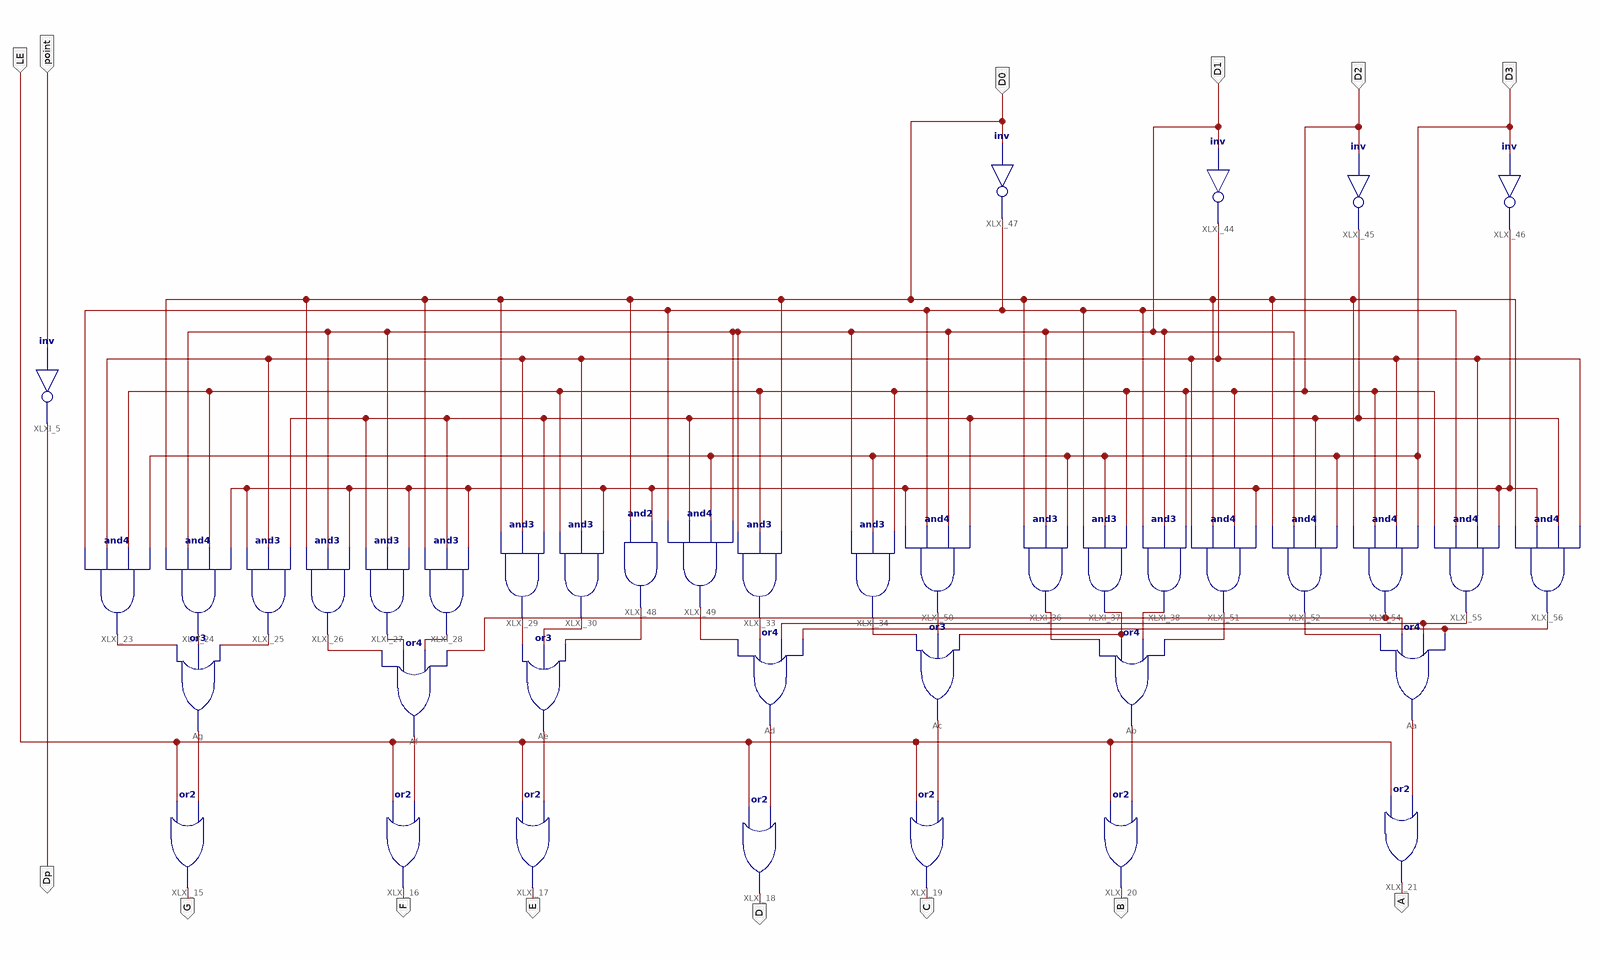
[diagram p0: schematic sheet 1]
// Xilinx ISE schematic MyMc14495.sch (kintex7) as structural Verilog: 40 symbols, 14 ports
module MyMc14495 (
  input  LE,
  input  point,
  input  D0,
  input  D1,
  input  D2,
  input  D3,
  output Dp,
  output G,
  output F,
  output E,
  output D,
  output C,
  output B,
  output A
);

  wire XLXN_5, XLXN_6, XLXN_7, XLXN_8, XLXN_9, XLXN_10, XLXN_11, XLXN_12, XLXN_13, XLXN_14, XLXN_19, XLXN_21,
       XLXN_22, XLXN_23, XLXN_24, XLXN_25, XLXN_36, XLXN_37, XLXN_38, XLXN_39, XLXN_40, XLXN_41, XLXN_42,
       XLXN_43, XLXN_46, XLXN_50, XLXN_51, XLXN_52, XLXN_69, XLXN_73, XLXN_79, XLXN_83;

  not XLXI_5 (Dp, point);
  or Ag (XLXN_5, XLXN_13, XLXN_12, XLXN_14);
  or Ae (XLXN_7, XLXN_23, XLXN_24, XLXN_25);
  or Ac (XLXN_9, XLXN_38, XLXN_39, XLXN_41);
  or Aa (XLXN_11, XLXN_46, XLXN_50, XLXN_51, XLXN_52);
  or Ad (XLXN_8, XLXN_36, XLXN_37, XLXN_51, XLXN_52);
  or Ab (XLXN_10, XLXN_40, XLXN_41, XLXN_42, XLXN_43);
  or XLXI_15 (G, LE, XLXN_5);
  or XLXI_16 (F, LE, XLXN_6);
  or XLXI_17 (E, LE, XLXN_7);
  or XLXI_18 (D, LE, XLXN_8);
  or XLXI_19 (C, LE, XLXN_9);
  or XLXI_20 (B, LE, XLXN_10);
  or XLXI_21 (A, LE, XLXN_11);
  or Af (XLXN_6, XLXN_22, XLXN_19, XLXN_21, XLXN_50);
  and XLXI_23 (XLXN_13, XLXN_69, XLXN_73, D2, D3);
  and XLXI_24 (XLXN_12, D0, D1, D2, XLXN_83);
  and XLXI_25 (XLXN_14, XLXN_83, XLXN_73, XLXN_79);
  and XLXI_26 (XLXN_22, D0, D1, XLXN_83);
  and XLXI_27 (XLXN_19, XLXN_79, D1, XLXN_83);
  and XLXI_28 (XLXN_21, D0, XLXN_79, XLXN_83);
  and XLXI_29 (XLXN_23, D0, XLXN_73, XLXN_79);
  and XLXI_30 (XLXN_24, D2, XLXN_73, XLXN_83);
  and XLXI_33 (XLXN_37, D1, D2, D0);
  and XLXI_34 (XLXN_38, D1, D3, D2);
  and XLXI_36 (XLXN_40, D0, D1, D3);
  and XLXI_37 (XLXN_41, XLXN_69, D3, D2);
  and XLXI_38 (XLXN_42, XLXN_69, D1, D2);
  not XLXI_44 (XLXN_73, D1);
  not XLXI_45 (XLXN_79, D2);
  not XLXI_46 (XLXN_83, D3);
  not XLXI_47 (XLXN_69, D0);
  and XLXI_48 (XLXN_25, D0, XLXN_83);
  and XLXI_49 (XLXN_36, XLXN_69, XLXN_79, D3, D1);
  and XLXI_50 (XLXN_39, XLXN_83, XLXN_69, D1, XLXN_79);
  and XLXI_51 (XLXN_43, XLXN_73, D0, D2, XLXN_83);
  and XLXI_52 (XLXN_46, D0, D1, XLXN_79, D3);
  and XLXI_54 (XLXN_50, D0, D2, XLXN_73, D3);
  and XLXI_55 (XLXN_51, D2, XLXN_69, XLXN_73, XLXN_83);
  and XLXI_56 (XLXN_52, D0, XLXN_83, XLXN_79, XLXN_73);
endmodule
